# EAGLE schematic Casillero (EAGLE 9.6.2)
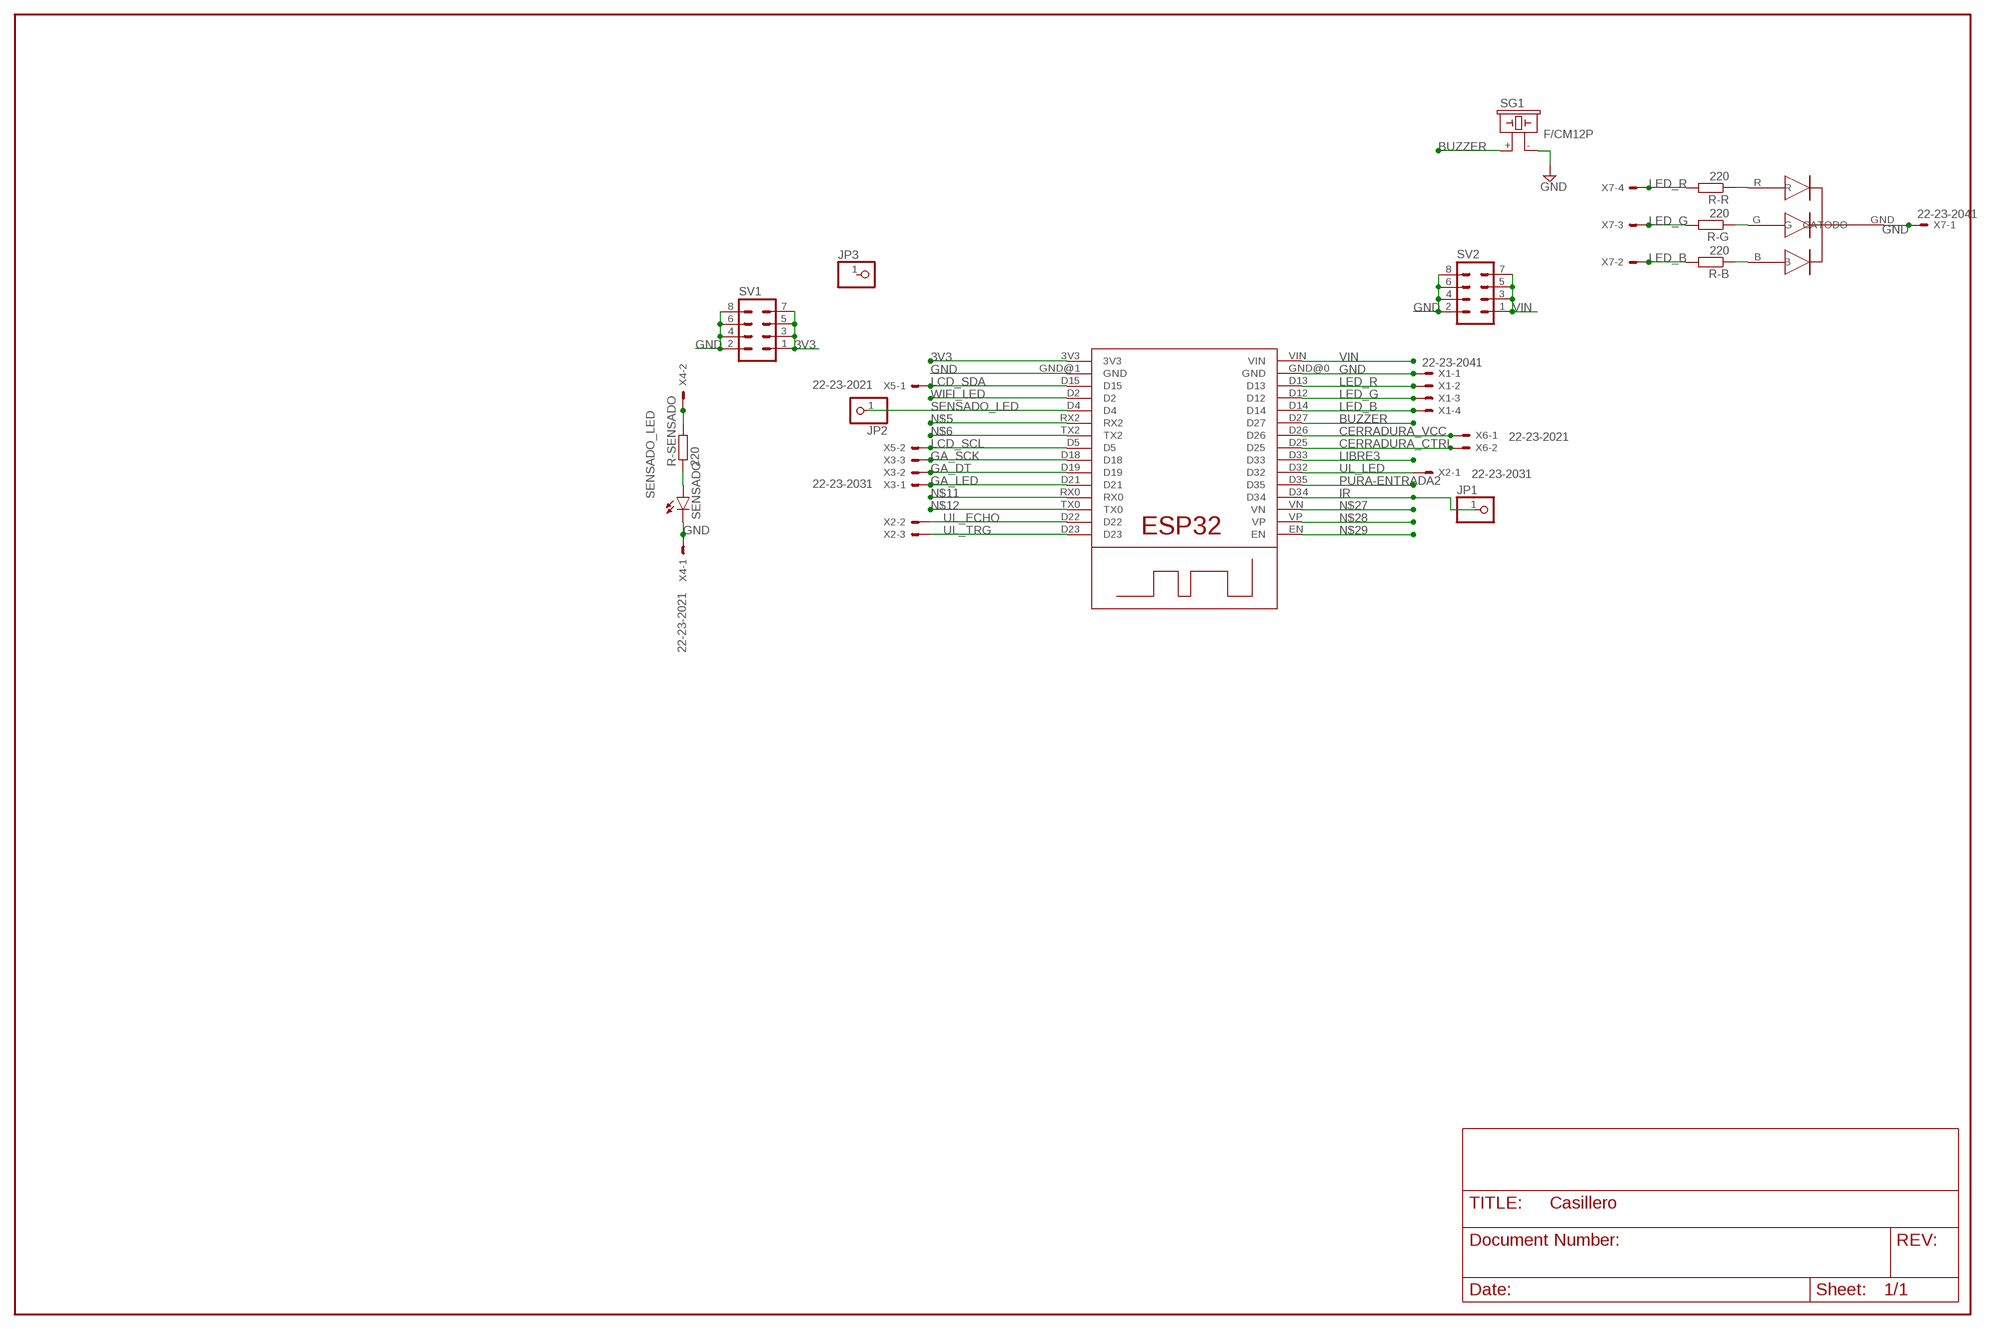
[diagram p0: schematic, sheet 1]

## Parts
JP1  PINHD-1X1  [1X01]
JP2  PINHD-1X1  [1X01]
JP3  PINHD-1X1  [1X01]
R-B  220  R-EU_0204/7  [0204/7]
R-G  220  R-EU_0204/7  [0204/7]
R-R  220  R-EU_0204/7  [0204/7]
R-SENSADO  220  R-EU_0204/7  [0204/7]
SENSADO  LED3MM  [LED3MM]
SG1  F/CM12P  [F/CM12P]
SV1  MA04-2  [MA04-2]
SV2  MA04-2  [MA04-2]
U$1  ESP32WROOM  [ESP32WROOM]
U$3  LEDRGB  [LEDRGB]
X1  22-23-2041  [22-23-2041]
X2  22-23-2031  [22-23-2031]
X3  22-23-2031  [22-23-2031]
X4  22-23-2021  [22-23-2021]
X5  22-23-2021  [22-23-2021]
X6  22-23-2021  [22-23-2021]
X7  22-23-2041  [22-23-2041]

## Nets
3V3: SV1.1 SV1.3 SV1.5 SV1.7 U$1.3V3
BUZZER: SG1.+ U$1.D27
CERRADURA_CTRL: U$1.D25 X6.2
CERRADURA_VCC: U$1.D26 X6.1
GA_DT: U$1.D19 X3.2
GA_LED: U$1.D21 X3.1
GA_SCK: U$1.D18 X3.3
GND: SENSADO.K(C) SG1.- SV1.2 SV1.4 SV1.6 SV1.8 SV2.2 SV2.4 SV2.6 SV2.8 U$1.GND@0(GND) U$1.GND@1(GND) U$3.GND(CATODO) X1.1 X4.1 X7.1
IR: JP1.1 U$1.D34
LCD_SCL: U$1.D5 X5.2
LCD_SDA: U$1.D15 X5.1
LED_B: R-B.2 U$1.D14 X1.4 X7.2
LED_G: R-G.2 U$1.D12 X1.3 X7.3
LED_R: R-R.2 U$1.D13 X1.2 X7.4
LIBRE3: U$1.D33
N$2: R-R.1 U$3.R
N$3: R-G.1 U$3.G
N$4: R-B.1 U$3.B
N$5: U$1.RX2
N$6: U$1.TX2
N$7: R-SENSADO.1 SENSADO.A
N$11: U$1.RX0
N$12: U$1.TX0
N$27: U$1.VN
N$28: U$1.VP
N$29: U$1.EN
PURA-ENTRADA2: U$1.D35
SENSADO_LED: JP2.1 R-SENSADO.2 U$1.D4 X4.2
UL_ECHO: U$1.D22 X2.2
UL_LED: U$1.D32 X2.1
UL_TRG: U$1.D23 X2.3
VIN: SV2.1 SV2.3 SV2.5 SV2.7 U$1.VIN
WIFI_LED: U$1.D2
Unconnected: JP3.1

## Library data of the parts
JP1-JP3 = pinhead:PINHD-1X1: PIN HEADER
R-B R-G R-R R-SENSADO = rcl:R-EU_: RESISTOR, European symbol; SPICEPREFIX: R
SENSADO = led:LED: LED OSRAM: - CHIPLED LG R971, LG N971, LY N971, LG Q971, LY Q971, LO R971, LY R971 LH N974, LH R974 LS Q976, LO Q976, LY Q976 LO Q996 - Hyper CHIPLED LW Q18S LB Q993, LB Q99A, LB R99A - SideLED LS A670, LO A670, LY A670, LG A670, LP A670 LB A673, LV A673, LT A673, LW A673 LH A674 LY A675 LS A676, LA A676, LO A676, LY A676, LW A676 LS A679, LY A679, LG A679 - Hyper Micro SIDELED® LS Y876, LA Y876, LO Y876, LY Y876 LT Y87S - SmartLED LW L88C, LW L88S LB L89C, LB L89S, LG L890 LS L89K, LO L89K, LY L89K LS L896, LA L896, LO L896, LY L896 - TOPLED LS T670, LO T670, LY T670, LG T670, LP T670 LSG T670, LSP T670, LSY T670, LOP T670, LYG T670 LG T671, LOG T671, LSG T671 LB T673, LV T673, LT T673, LW T673 LH T674 LS T676, LA T676, LO T676, LY T676, LB T676, LH T676, LSB T676, LW T676 LB T67C, LV T67C, LT T67C, LS T67K, LO T67K, LY T67K, LW E67C LS E67B, LA E67B, LO E67B, LY E67B, LB E67C, LV E67C, LT E67C LW T67C LS T679, LY T679, LG T679 LS T770, LO T770, LY T770, LG T770, LP T770 LB T773, LV T773, LT T773, LW T773 LH T774 LS E675, LA E675, LY E675, LS T675 LS T776, LA T776, LO T776, LY T776, LB T776 LHGB T686 LT T68C, LB T68C - Hyper Mini TOPLED® LB M676 - Mini TOPLED Santana® LG M470 LS M47K, LO M47K, LY M47K Source: http://www.osram.convergy.de LUXEON: - LUMILED® LXK2-PW12-R00, LXK2-PW12-S00, LXK2-PW14-U00, LXK2-PW14-V00 LXK2-PM12-R00, LXK2-PM12-S00, LXK2-PM14-U00 LXK2-PE12-Q00, LXK2-PE12-R00, LXK2-PE12-S00, LXK2-PE14-T00, LXK2-PE14-U00 LXK2-PB12-K00, LXK2-PB12-L00, LXK2-PB12-M00, LXK2-PB14-N00, LXK2-PB14-P00, LXK2-PB14-Q00 LXK2-PR12-L00, LXK2-PR12-M00, LXK2-PR14-Q00, LXK2-PR14-R00 LXK2-PD12-Q00, LXK2-PD12-R00, LXK2-PD12-S00 LXK2-PH12-R00, LXK2-PH12-S00 LXK2-PL12-P00, LXK2-PL12-Q00, LXK2-PL12-R00 Source: www.luxeon.com KINGBRIGHT: KA-3528ASYC Source: www.kingbright.com
SG1 = buzzer:F/CM12P: BUZZER Source: Buerklin; OC_FARNELL: unknown; OC_NEWARK: unknown
SV1 SV2 = con-lstb:MA04-2: PIN HEADER; OC_FARNELL: unknown; OC_NEWARK: unknown
U$1 = MODULAR:ESP32WROOM
U$3 = MODULAR:LEDRGB
X1 X7 = con-molex:22-23-2041: .100" (2.54mm) Center Header - 4 Pin; MF: MOLEX; MPN: 22-23-2041; OC_FARNELL: 1462920; OC_NEWARK: 38C0355
X2 X3 = con-molex:22-23-2031: .100" (2.54mm) Center Header - 3 Pin; MF: MOLEX; MPN: 22-23-2031; OC_FARNELL: 1462950; OC_NEWARK: 30C0862
X4-X6 = con-molex:22-23-2021: .100" (2.54mm) Center Header - 2 Pin; MF: MOLEX; MPN: 22-23-2021; OC_FARNELL: 1462926; OC_NEWARK: 25C3832